# Altium schematic sheet 04_Seven_Seg.SchDoc: ECE315 Analog
size A; Date: 4/25/2017; ApprovedBy: JSK; CheckedBy: JSK; Author: JSK; CompanyName: University of Wisconsin; DrawnBy: JSK; Engineer: JSK; Organization: ECE 315; Address1: College of Engineering; Address2: 1415 Engineering Drive; Address3: Madison, WI 53706; Address4: ECE 315 Fall 2017; Revision: A; SheetNumber: 4; SheetTotal: 11; AssemblyNumber: ECE315-F19; ApprovedDate: 04/02/2019
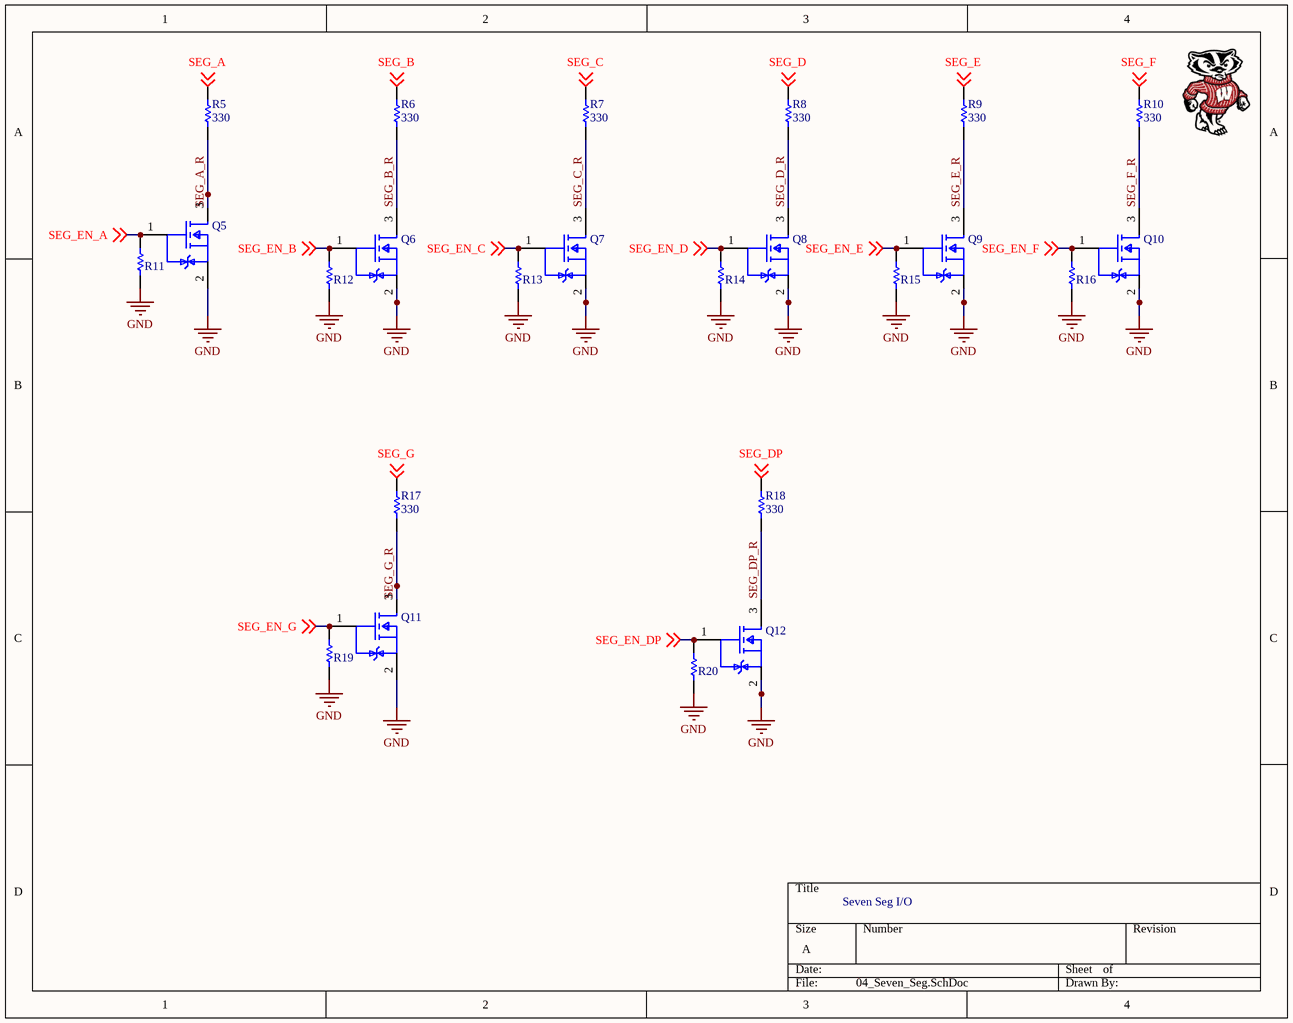
[diagram p0: 04_Seven_Seg.SchDoc]

## Parts
Q5  SSM3K329R,LF  [FP-2-3Z1A-MFG]  (value not drawn)
Q6  SSM3K329R,LF  [FP-2-3Z1A-MFG]  (value not drawn)
Q7  SSM3K329R,LF  [FP-2-3Z1A-MFG]  (value not drawn)
Q8  SSM3K329R,LF  [FP-2-3Z1A-MFG]  (value not drawn)
Q9  SSM3K329R,LF  [FP-2-3Z1A-MFG]  (value not drawn)
Q10  SSM3K329R,LF  [FP-2-3Z1A-MFG]  (value not drawn)
Q11  SSM3K329R,LF  [FP-2-3Z1A-MFG]  (value not drawn)
Q12  SSM3K329R,LF  [FP-2-3Z1A-MFG]  (value not drawn)
R5  330  [RES_0805]
R6  330  [RES_0805]
R7  330  [RES_0805]
R8  330  [RES_0805]
R9  330  [RES_0805]
R10  330  [RES_0805]
R11  RES_0805_K_010.00  [RES_0805]  (value not drawn)
R12  RES_0805_K_010.00  [RES_0805]  (value not drawn)
R13  RES_0805_K_010.00  [RES_0805]  (value not drawn)
R14  RES_0805_K_010.00  [RES_0805]  (value not drawn)
R15  RES_0805_K_010.00  [RES_0805]  (value not drawn)
R16  RES_0805_K_010.00  [RES_0805]  (value not drawn)
R17  330  [RES_0805]
R18  330  [RES_0805]
R19  RES_0805_K_010.00  [RES_0805]  (value not drawn)
R20  RES_0805_K_010.00  [RES_0805]  (value not drawn)

## Nets
GND: Q5.2(SOURCE) Q6.2(SOURCE) Q7.2(SOURCE) Q8.2(SOURCE) Q9.2(SOURCE) Q10.2(SOURCE) Q11.2(SOURCE) Q12.2(SOURCE) R11.1 R12.1 R13.1 R14.1 R15.1 R16.1 R19.1 R20.1
SEG_A: R5.2 ; off-sheet SEG_A
SEG_A_R: Q5.3(DRAIN) R5.1
SEG_B: R6.2 ; off-sheet SEG_B
SEG_B_R: Q6.3(DRAIN) R6.1
SEG_C: R7.2 ; off-sheet SEG_C
SEG_C_R: Q7.3(DRAIN) R7.1
SEG_D: R8.2 ; off-sheet SEG_D
SEG_D_R: Q8.3(DRAIN) R8.1
SEG_DP: R18.2 ; off-sheet SEG_DP
SEG_DP_R: Q12.3(DRAIN) R18.1
SEG_E: R9.2 ; off-sheet SEG_E
SEG_E_R: Q9.3(DRAIN) R9.1
SEG_EN_A: Q5.1(GATE) R11.2 ; off-sheet SEG_EN_A
SEG_EN_B: Q6.1(GATE) R12.2 ; off-sheet SEG_EN_B
SEG_EN_C: Q7.1(GATE) R13.2 ; off-sheet SEG_EN_C
SEG_EN_D: Q8.1(GATE) R14.2 ; off-sheet SEG_EN_D
SEG_EN_DP: Q12.1(GATE) R20.2 ; off-sheet SEG_EN_DP
SEG_EN_E: Q9.1(GATE) R15.2 ; off-sheet SEG_EN_E
SEG_EN_F: Q10.1(GATE) R16.2 ; off-sheet SEG_EN_F
SEG_EN_G: Q11.1(GATE) R19.2 ; off-sheet SEG_EN_G
SEG_F: R10.2 ; off-sheet SEG_F
SEG_F_R: Q10.3(DRAIN) R10.1
SEG_G: R17.2 ; off-sheet SEG_G
SEG_G_R: Q11.3(DRAIN) R17.1

## Notes on the sheet
- Seven Seg I/O

## Library data of the parts
Q5-Q12 = CMP-35916-000013-1: MOSFET N CH 30V 3.5A 2-3Z1A; Gate to Source Voltage (Vgs): 12V; Input Capacitance: 123pF; Drain to Source Resistance: 290mR; Rds On Max: 126mR; Max Power Dissipation: 1W; Continuous Drain Current (ID): 3.5A; Mount: Surface Mount; Case/Package: SOT-23-3; Drain to Source Breakdown Voltage: 30V; Packaging: Tape and Reel; Drain to Source Voltage (Vdss): 30V; Power Dissipation: 1W; Package Quantity: 3000
R5-R10 R17 R18 = RES_0805_R_330.00: RES 330 OHM 1% 1/8W 0805; Manufacturer 1: Stackpole Electronics; Manufacturer Part Number 1: RMCF0805FT330R; Temperature Coefficient: 100ppm/°C; Resistance: 330R; Max Power Dissipation: 125mW; Features: Automotive AEC-Q200; Number of Terminations: 2; RoHS: Yes; Packaging: Tape and Reel; Tolerance: 1%; Category: Chip SMD Resistors; Supplier 1: Digi-Key; Supplier Part Number 1: RMCF0805FT330RCT-ND; Stock 1: 205996; Pricing 1: 1=0.10000, 10=0.02700, 100=0.01090, 1000=0.00488, 2500=0.00423 (USD); Mount: Surface Mount; Case/Package: 0805; Case Code (Metric): 2012; Case Code (Imperial): 0805; Contact Plating: Tin,Matte; Min Operating Temperature: -55°C; Max Operating Temperature: 155°C; Resistor Type: Thick Film; Series: RMCF; Construction: Rectangular; Length: 0.079inch; Width: 0.049inch; Height: 0.026inch; Depth: 1.25mm; Radiation Hardening: No; Military Standard: Not; Lead Free: Lead Free; RoHS Compliant: Yes; ComponentLink1URL: http://components.arrow.com/part/dataview/40963487S9848862N1174?src-supplier=Arrow+Electronics; ComponentLink1Description: http://components.arrow.com/part/dataview/40963487S9848862N1174?src-supplier=Arrow+Electronics; ComponentLink2URL: https://www.seielect.com/catalog/SEI-RMCF_RMCP.pdf?src-supplier=Avnet; ComponentLink2Description: https://www.seielect.com/catalog/SEI-RMCF_RMCP.pdf?src-supplier=Avnet; ComponentLink3URL: https://www.seielect.com/Catalog/SEI-RMCF_RMCP.pdf?src-supplier=Digi-Key; ComponentLink3Description: https://www.seielect.com/Catalog/SEI-RMCF_RMCP.pdf?src-supplier=Digi-Key; ComponentLink4URL: https://www.seielect.com/catalog/SEI-Packaging.pdf?src-supplier=Digi-Key; ComponentLink4Description: https://www.seielect.com/catalog/SEI-Packaging.pdf?src-supplier=Digi-Key; ComponentLink5URL: https://www.verical.com/server-webapp/html/getDatasheet?partID=559884&src-supplier=Verical; ComponentLink5Description: https://www.verical.com/server-webapp/html/getDatasheet?partID=559884&src-supplier=Verical
R11-R16 R19 R20 = RES_0805_K_010.00: RES SMD 10K OHM 1% 1/8W 0805; Manufacturer 1: Yageo; Manufacturer Part Number 1: RC0805FR-0710KL; Temperature Coefficient: 100ppm/°C; Power Rating: 125mW; Voltage Rating: 150V; Resistance: 10kR; Supplier 1: Digi-Key; Supplier Part Number 1: 311-10.0KCRCT-ND; Stock 1: 7562122; Pricing 1: 1=0.10000, 10=0.04200, 100=0.01690, 1000=0.00759, 2500=0.00659 (USD); RoHS: Yes; Case/Package: 0805; Case Code (Imperial): 0805; Case Code (Metric): 2012; Min Operating Temperature: -55°C; Max Operating Temperature: 155°C; Tolerance: 1%; Packaging: Tape and Reel; Features: Moisture Resistant; Termination: SMD/SMT; Number of Terminations: 2; Military Standard: Not; Max Power Dissipation: 125mW; Package Quantity: 1; Length: 2mm; Height: 0.024inch; Width: 0.049inch; Depth: 1.25mm; Lead Free: Lead Free; REACH SVHC: Unknown; ComponentLink1URL: https://datasheet.ciiva.com/11808/0900766b8106beab-11808151.pdf?src-supplier=RSComponents; ComponentLink1Description: https://datasheet.ciiva.com/11808/0900766b8106beab-11808151.pdf?src-supplier=RSComponents; ComponentLink2URL: https://datasheet.ciiva.com/12669/rc0805-12669688.pdf?src-supplier=Mouser; ComponentLink2Description: https://datasheet.ciiva.com/12669/rc0805-12669688.pdf?src-supplier=Mouser; ComponentLink3URL: https://datasheet.ciiva.com/46447/444164-46447563.pdf?src-supplier=Element14; ComponentLink3Description: https://datasheet.ciiva.com/46447/444164-46447563.pdf?src-supplier=Element14; ComponentLink4URL: https://datasheet.ciiva.com/2456/pyu-r-int-thick-7-2456972.pdf?src-supplier=Digi-Key; ComponentLink4Description: https://datasheet.ciiva.com/2456/pyu-r-int-thick-7-2456972.pdf?src-supplier=Digi-Key; ComponentLink5URL: https://datasheet.ciiva.com/2456/pyu-r-int-thick-7-2456973.pdf?src-supplier=Digi-Key; ComponentLink5Description: https://datasheet.ciiva.com/2456/pyu-r-int-thick-7-2456973.pdf?src-supplier=Digi-Key; ComponentLink6URL: https://datasheet.ciiva.com/2456/pyu-r-int-thick-7-2456974.pdf?src-supplier=Digi-Key; ComponentLink6Description: https://datasheet.ciiva.com/2456/pyu-r-int-thick-7-2456974.pdf?src-supplier=Digi-Key; ComponentLink7URL: https://datasheet.ciiva.com/16747/rc0805-16747087.pdf?src-supplier=Future+Electronics; ComponentLink7Description: https://datasheet.ciiva.com/16747/rc0805-16747087.pdf?src-supplier=Future+Electronics; Category: Chip SMD Resistors; Size Code: 0805; Resistor Type: Thick Film; Series: RC; Construction: Rectangular; Resistance Tolerance: 1%; Technology: THICK FILM; RoHS Compliant: Yes